# Altium project ISB_V3.PrjPCB
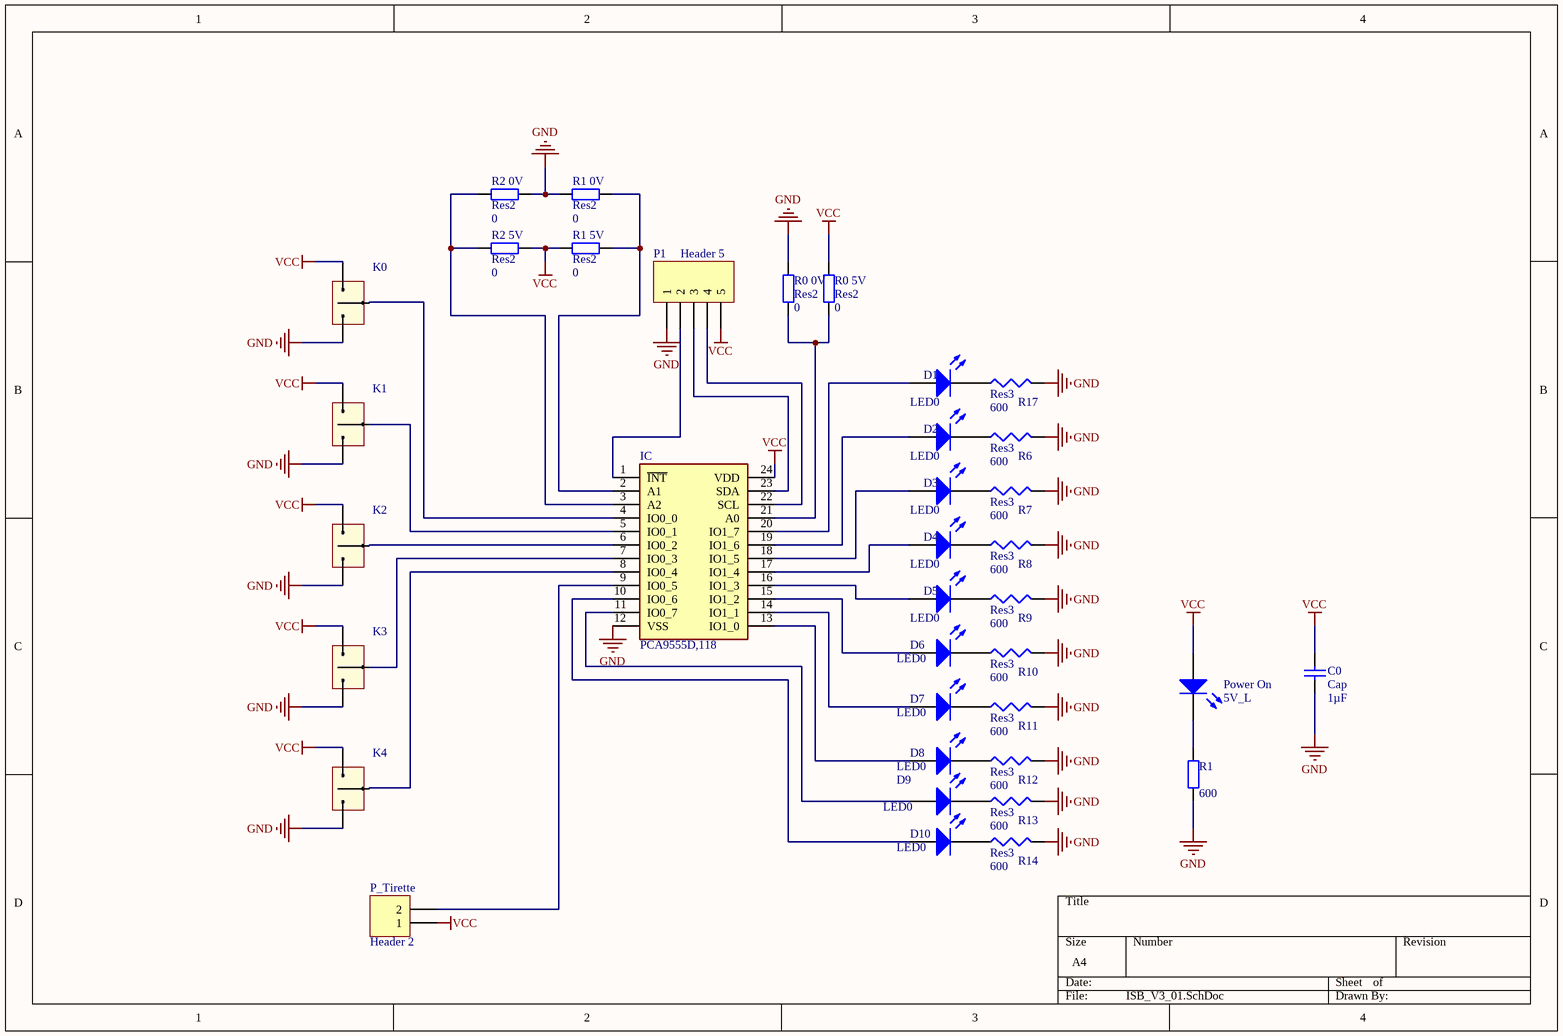
[diagram p0: ISB_V3_01.SchDoc]
1 sheet, 37 parts. Net scope: global (net labels, ports and power ports of the same name join across sheets).
Board file: PCB_ISB_V3.PcbDoc

## Sheet ISB_V3_01.SchDoc
size A4

### Parts
C0  Cap  value 1µF  [Capacitor 1206]
D1  LED0  [3.2X1.6X1.1]
D2  LED0  [3.2X1.6X1.1]
D3  LED0  [3.2X1.6X1.1]
D4  LED0  [3.2X1.6X1.1]
D5  LED0  [3.2X1.6X1.1]
D6  LED0  [3.2X1.6X1.1]
D7  LED0  [3.2X1.6X1.1]
D8  LED0  [3.2X1.6X1.1]
D9  LED0  [3.2X1.6X1.1]
D10  LED0  [3.2X1.6X1.1]
IC  PCA9555D,118  [SOIC127P1032X265-24N]
K0  Switch  [SWITCH]  (value not drawn)
K1  Switch  [SWITCH]  (value not drawn)
K2  Switch  [SWITCH]  (value not drawn)
K3  Switch  [SWITCH]  (value not drawn)
K4  Switch  [SWITCH]  (value not drawn)
P1  Header 5  [JST-XH 5]
P_Tirette  Header 2  [HDR1X2]
Power_On  5V_L  [KP-3216SEC]
R0_0V  Res2  value 0  [Resistor 1206]
R0_5V  Res2  value 0  [Resistor 1206]
R1  value 600  [Resistor 1206]  (hidden comment: Res2)
R1_0V  Res2  value 0  [Resistor 1206]
R1_5V  Res2  value 0  [Resistor 1206]
R2_0V  Res2  value 0  [Resistor 1206]
R2_5V  Res2  value 0  [Resistor 1206]
R6  Res3  value 600  [Resistor 1206]
R7  Res3  value 600  [Resistor 1206]
R8  Res3  value 600  [Resistor 1206]
R9  Res3  value 600  [Resistor 1206]
R10  Res3  value 600  [Resistor 1206]
R11  Res3  value 600  [Resistor 1206]
R12  Res3  value 600  [Resistor 1206]
R13  Res3  value 600  [Resistor 1206]
R14  Res3  value 600  [Resistor 1206]
R17  Res3  value 600  [Resistor 1206]

### Nets
GND: C0.1 IC.12(VSS) K0.2(R) K1.2(R) K2.2(R) K3.2(R) K4.2(R) P1.1 R0_0V.2 R1.1 R1_0V.2 R2_0V.1 R6.2 R7.2 R8.2 R9.2 R10.2 R11.2 R12.2 R13.2 R14.2 R17.2
VCC: C0.2 IC.24(VDD) K0.0(L) K1.0(L) K2.0(L) K3.0(L) K4.0(L) P1.5 P_Tirette.1 Power_On.1(A) R0_5V.2 R1_5V.2 R2_5V.2
NetD1_1: D1.1(A) IC.20(IO1_7)
NetD1_2: D1.2(K) R17.1
NetD2_1: D2.1(A) IC.19(IO1_6)
NetD2_2: D2.2(K) R6.1
NetD3_1: D3.1(A) IC.18(IO1_5)
NetD3_2: D3.2(K) R7.1
NetD4_1: D4.1(A) IC.17(IO1_4)
NetD4_2: D4.2(K) R8.1
NetD5_1: D5.1(A) IC.16(IO1_3)
NetD5_2: D5.2(K) R9.1
NetD6_1: D6.1(A) IC.15(IO1_2)
NetD6_2: D6.2(K) R10.1
NetD7_1: D7.1(A) IC.14(IO1_1)
NetD7_2: D7.2(K) R11.1
NetD8_1: D8.1(A) IC.13(IO1_0)
NetD8_2: D8.2(K) R12.1
NetD9_1: D9.1(A) IC.11(IO0_7)
NetD9_2: D9.2(K) R13.1
NetD10_1: D10.1(A) IC.10(IO0_6)
NetD10_2: D10.2(K) R14.1
NetIC_1: IC.1(~{INT}) P1.2
NetIC_2: IC.2(A1) R1_0V.1 R1_5V.1
NetIC_3: IC.3(A2) R2_0V.2 R2_5V.1
NetIC_4: IC.4(IO0_0) K0.1(M)
NetIC_5: IC.5(IO0_1) K1.1(M)
NetIC_6: IC.6(IO0_2) K2.1(M)
NetIC_7: IC.7(IO0_3) K3.1(M)
NetIC_8: IC.8(IO0_4) K4.1(M)
NetIC_9: IC.9(IO0_5) P_Tirette.2
NetIC_21: IC.21(A0) R0_0V.1 R0_5V.1
NetIC_22: IC.22(SCL) P1.4
NetIC_23: IC.23(SDA) P1.3
NetPower_On_2: Power_On.2(K) R1.2

### Library data of the parts
C0 = Cap: Capacitor; Published: 8-Jun-2000; LatestRevisionDate: 17-Jul-2002; LatestRevisionNote: Re-released for DXP Platform.; PackageReference: RAD-0.3; Publisher: Altium Limited; PackageDescription: Radial Cap, Thru-Hole; 2 Leads; 0.3 in Pin Spacing
D1-D10 = LED0: Typical INFRARED GaAs LED; Published: 8-Jun-2000; LatestRevisionDate: 08-Jul-2005; LatestRevisionNote: Mech Layer 1 removed.; PackageReference: LED-0; Publisher: Altium Limited; PackageDescription: LED; 2 Leads
IC = PCA9555D,118: Integrated Circuit; Manufacturer_Name: NXP; Datasheet Link: http://www.nxp.com/docs/en/data-sheet/PCA9555.pdf; Height: 2.65mm; Manufacturer_Part_Number: PCA9555D,118; Mouser Part Number: 771-PCA9555D-T; Mouser Price/Stock: https://www.mouser.co.uk/ProductDetail/NXP-Semiconductors/PCA9555D118?qs=LOCUfHb8d9tGZvX3C7Uu1g%3D%3D; Arrow Part Number: PCA9555D,118; Arrow Price/Stock: https://www.arrow.com/en/products/pca9555d118/nxp-semiconductors?region=nac
K0-K4 = Switch: 3 pos switch, 09.03290.01
P1 = Header 5: Header, 5-Pin; LatestRevisionDate: 17-Jul-2002; LatestRevisionNote: Re-released for DXP Platform.; Publisher: Altium Limited
P_Tirette = Header 2: Header, 2-Pin; LatestRevisionDate: 17-Jul-2002; LatestRevisionNote: Re-released for DXP Platform.; Publisher: Altium Limited
Power_On = LED2: Typical RED, GREEN, YELLOW, AMBER GaAs LED; Published: 8-Jun-2000; LatestRevisionDate: 17-Jul-2002; LatestRevisionNote: Re-released for DXP Platform.; PackageVersion: Feb-2002; PackageReference: 3.2X1.6X1.1; Publisher: Altium Limited; PackageDescription: SM LED; 2 Flat Leads
R0_0V R0_5V R1 R1_0V R1_5V R2_0V R2_5V = Res2: Resistor; Published: 8-Jun-2000; LatestRevisionDate: 17-Jul-2002; LatestRevisionNote: Re-released for DXP Platform.; PackageReference: AXIAL-0.4; Publisher: Altium Limited; PackageDescription: Axial Device, Thru-Hole; 2 Leads; 0.4 in Pin Spacing
R6-R14 R17 = Res3: Resistor; Published: 8-Jun-2000; LatestRevisionDate: 29-May-2009; LatestRevisionNote: IPC-7351 Footprint Added.; PackageReference: J1-0603; Publisher: Altium Limited; PackageDescription: Chip Resistor